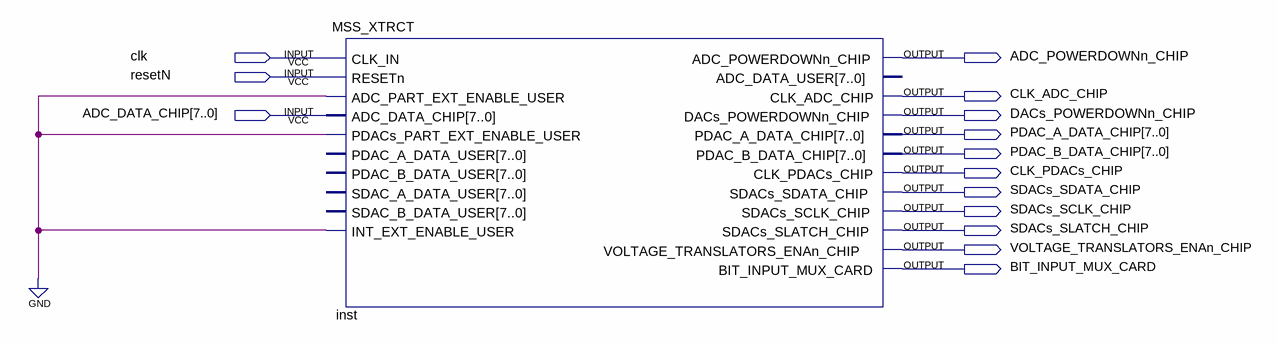
[diagram p0: schematic sheet]
// Quartus schematic MSS_BASIC.bdf as structural Verilog: 1 symbols, 14 pins
module MSS_BASIC (
  input  clk,
  input  resetN,
  input  [7:0] ADC_DATA_CHIP,
  output ADC_POWERDOWNn_CHIP,
  output CLK_ADC_CHIP,
  output DACs_POWERDOWNn_CHIP,
  output [7:0] PDAC_A_DATA_CHIP,
  output [7:0] PDAC_B_DATA_CHIP,
  output CLK_PDACs_CHIP,
  output SDACs_SDATA_CHIP,
  output SDACs_SCLK_CHIP,
  output SDACs_SLATCH_CHIP,
  output VOLTAGE_TRANSLATORS_ENAn_CHIP,
  output BIT_INPUT_MUX_CARD
);

  MSS_XTRCT inst (
    .CLK_IN(clk), .RESETn(resetN), .ADC_PART_EXT_ENABLE_USER(1'b0), .ADC_DATA_CHIP(ADC_DATA_CHIP),
    .PDACs_PART_EXT_ENABLE_USER(1'b0), .INT_EXT_ENABLE_USER(1'b0), .ADC_POWERDOWNn_CHIP(ADC_POWERDOWNn_CHIP),
    .CLK_ADC_CHIP(CLK_ADC_CHIP), .DACs_POWERDOWNn_CHIP(DACs_POWERDOWNn_CHIP),
    .PDAC_A_DATA_CHIP(PDAC_A_DATA_CHIP), .PDAC_B_DATA_CHIP(PDAC_B_DATA_CHIP),
    .CLK_PDACs_CHIP(CLK_PDACs_CHIP), .SDACs_SDATA_CHIP(SDACs_SDATA_CHIP), .SDACs_SCLK_CHIP(SDACs_SCLK_CHIP),
    .SDACs_SLATCH_CHIP(SDACs_SLATCH_CHIP), .VOLTAGE_TRANSLATORS_ENAn_CHIP(VOLTAGE_TRANSLATORS_ENAn_CHIP),
    .BIT_INPUT_MUX_CARD(BIT_INPUT_MUX_CARD));  // open: PDAC_A_DATA_USER, PDAC_B_DATA_USER, SDAC_A_DATA_USER, SDAC_B_DATA_USER, ADC_DATA_USER
endmodule
